# Altium schematic sheet Digital Output.SchDoc
size A4; SheetNumber: 4; SheetTotal: 11
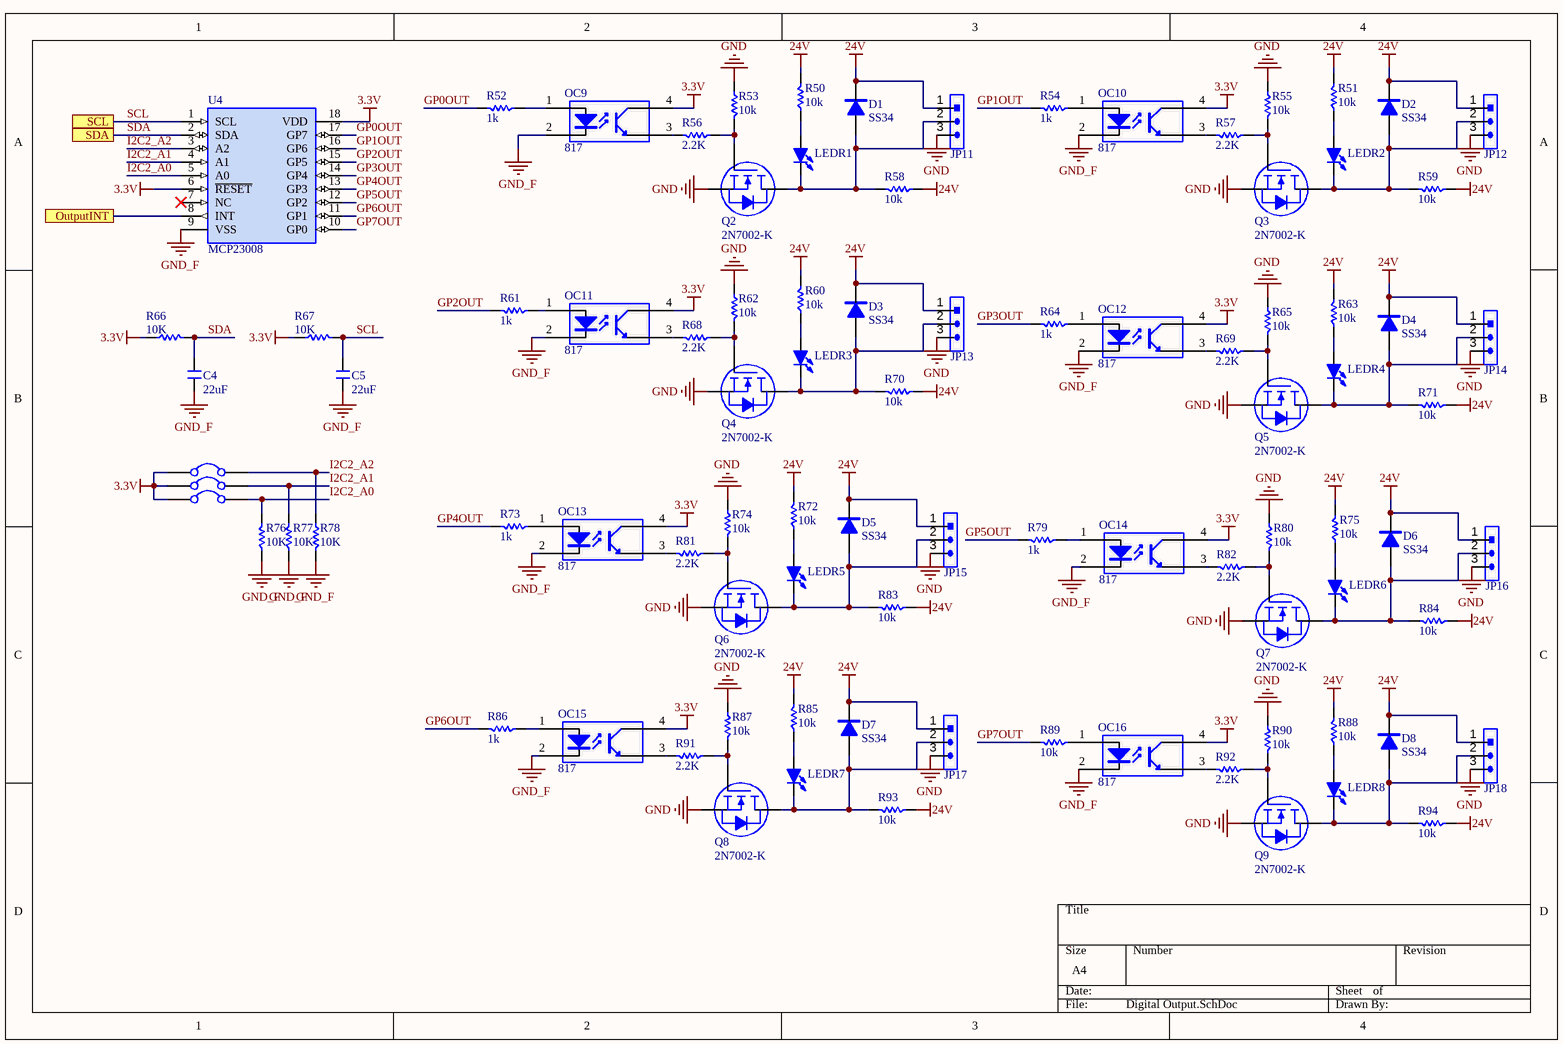
[diagram p0: Digital Output.SchDoc]

## Parts
C4  22uF  [C 0805]
C5  22uF  [C 0805]
D1  SS34  [SMA]
D2  SS34  [SMA]
D3  SS34  [SMA]
D4  SS34  [SMA]
D5  SS34  [SMA]
D6  SS34  [SMA]
D7  SS34  [SMA]
D8  SS34  [SMA]
JP11  HDR-1X3  [KF301-3P]  (value not drawn)
JP12  HDR-1X3  [KF301-3P]  (value not drawn)
JP13  HDR-1X3  [KF301-3P]  (value not drawn)
JP14  HDR-1X3  [KF301-3P]  (value not drawn)
JP15  HDR-1X3  [KF301-3P]  (value not drawn)
JP16  HDR-1X3  [KF301-3P]  (value not drawn)
JP17  HDR-1X3  [KF301-3P]  (value not drawn)
JP18  HDR-1X3  [KF301-3P]  (value not drawn)
LEDR1  LED-SMD  [LED 0805R]  (value not drawn)
LEDR2  LED-SMD  [LED 0805R]  (value not drawn)
LEDR3  LED-SMD  [LED 0805R]  (value not drawn)
LEDR4  LED-SMD  [LED 0805R]  (value not drawn)
LEDR5  LED-SMD  [LED 0805R]  (value not drawn)
LEDR6  LED-SMD  [LED 0805R]  (value not drawn)
LEDR7  LED-SMD  [LED 0805R]  (value not drawn)
LEDR8  LED-SMD  [LED 0805R]  (value not drawn)
OC9  817  [PC817-SMD]
OC10  817  [PC817-SMD]
OC11  817  [PC817-SMD]
OC12  817  [PC817-SMD]
OC13  817  [PC817-SMD]
OC14  817  [PC817-SMD]
OC15  817  [PC817-SMD]
OC16  817  [PC817-SMD]
Q2  2N7002-K  [SOT23-3L]
Q3  2N7002-K  [SOT23-3L]
Q4  2N7002-K  [SOT23-3L]
Q5  2N7002-K  [SOT23-3L]
Q6  2N7002-K  [SOT23-3L]
Q7  2N7002-K  [SOT23-3L]
Q8  2N7002-K  [SOT23-3L]
Q9  2N7002-K  [SOT23-3L]
R50  10k  [R 0805]
R51  10k  [R 0805]
R52  1k  [R 0805]
R53  10k  [R 0805]
R54  1k  [R 0805]
R55  10k  [R 0805]
R56  2.2K  [R 0805]
R57  2.2K  [R 0805]
R58  10k  [R 0805]
R59  10k  [R 0805]
R60  10k  [R 0805]
R61  1k  [R 0805]
R62  10k  [R 0805]
R63  10k  [R 0805]
R64  1k  [R 0805]
R65  10k  [R 0805]
R66  10K  [R 0805]
R67  10K  [R 0805]
R68  2.2K  [R 0805]
R69  2.2K  [R 0805]
R70  10k  [R 0805]
R71  10k  [R 0805]
R72  10k  [R 0805]
R73  1k  [R 0805]
R74  10k  [R 0805]
R75  10k  [R 0805]
R76  10K  [R 0805]
R77  10K  [R 0805]
R78  10K  [R 0805]
R79  1k  [R 0805]
R80  10k  [R 0805]
R81  2.2K  [R 0805]
R82  2.2K  [R 0805]
R83  10k  [R 0805]
R84  10k  [R 0805]
R85  10k  [R 0805]
R86  1k  [R 0805]
R87  10k  [R 0805]
R88  10k  [R 0805]
R89  10k  [R 0805]
R90  10k  [R 0805]
R91  2.2K  [R 0805]
R92  2.2K  [R 0805]
R93  10k  [R 0805]
R94  10k  [R 0805]
SB7  Solder Bridge  [Solder Bridge Open]  (value not drawn)
SB8  Solder Bridge  [Solder Bridge Open]  (value not drawn)
SB9  Solder Bridge  [Solder Bridge Open]  (value not drawn)
U4  MCP23008  [SOP18W_M]

## Ports
OutputINT, SCL, SDA

## Nets
3.3V: OC9.4(C) OC10.4(C) OC11.4(C) OC12.4(C) OC13.4(C) OC14.4(C) OC15.4(C) OC16.4(C) R66.1 R67.1 SB7.1 SB8.1 SB9.1 U4.6(~{RESET}) U4.18(VDD)
24V: D1.2(K) D2.2(K) D3.2(K) D4.2(K) D5.2(K) D6.2(K) D7.2(K) D8.2(K) JP11.1 JP12.1 JP13.1 JP14.1 JP15.1 JP16.1 JP17.1 JP18.1 R50.2 R51.2 R58.1 R59.1 R60.2 R63.2 R70.1 R71.1 R72.2 R75.2 R83.1 R84.1 R85.2 R88.2 R93.1 R94.1
GND: JP11.3 JP12.3 JP13.3 JP14.3 JP15.3 JP16.3 JP17.3 JP18.3 Q2.2(S) Q3.2(S) Q4.2(S) Q5.2(S) Q6.2(S) Q7.2(S) Q8.2(S) Q9.2(S) R53.1 R55.1 R62.1 R65.1 R74.1 R80.1 R87.1 R90.1
GND_F: C4.1 C5.1 OC9.2(K) OC10.2(K) OC11.2(K) OC12.2(K) OC13.2(K) OC14.2(K) OC15.2(K) OC16.2(K) R76.1 R77.1 R78.2 U4.9(VSS)
GP0OUT: R52.2 U4.17(GP7)
GP1OUT: R54.2 U4.16(GP6)
GP2OUT: R61.2 U4.15(GP5)
GP3OUT: R64.2 U4.14(GP4)
GP4OUT: R73.2 U4.13(GP3)
GP5OUT: R79.2 U4.12(GP2)
GP6OUT: R86.2 U4.11(GP1)
GP7OUT: R89.2 U4.10(GP0)
I2C2_A0: R76.2 SB9.2 U4.5(A0)
I2C2_A1: R77.2 SB8.2 U4.4(A1)
I2C2_A2: R78.1 SB7.2 U4.3(A2)
OutputINT: U4.8(INT) ; port OutputINT
SCL: C5.2 R67.2 U4.1(SCL) ; port SCL
SDA: C4.2 R66.2 U4.2(SDA) ; port SDA
NetD1_1: D1.1(A) JP11.2 LEDR1.2(K) Q2.3(D) R58.2
NetD2_1: D2.1(A) JP12.2 LEDR2.2(K) Q3.3(D) R59.2
NetD3_1: D3.1(A) JP13.2 LEDR3.2(K) Q4.3(D) R70.2
NetD4_1: D4.1(A) JP14.2 LEDR4.2(K) Q5.3(D) R71.2
NetD5_1: D5.1(A) JP15.2 LEDR5.2(K) Q6.3(D) R83.2
NetD6_1: D6.1(A) JP16.2 LEDR6.2(K) Q7.3(D) R84.2
NetD7_1: D7.1(A) JP17.2 LEDR7.2(K) Q8.3(D) R93.2
NetD8_1: D8.1(A) JP18.2 LEDR8.2(K) Q9.3(D) R94.2
NetLEDR1_1: LEDR1.1(A) R50.1
NetLEDR2_1: LEDR2.1(A) R51.1
NetLEDR3_1: LEDR3.1(A) R60.1
NetLEDR4_1: LEDR4.1(A) R63.1
NetLEDR5_1: LEDR5.1(A) R72.1
NetLEDR6_1: LEDR6.1(A) R75.1
NetLEDR7_1: LEDR7.1(A) R85.1
NetLEDR8_1: LEDR8.1(A) R88.1
NetOC9_1: OC9.1(A) R52.1
NetOC9_3: OC9.3(E) R56.2
NetOC10_1: OC10.1(A) R54.1
NetOC10_3: OC10.3(E) R57.2
NetOC11_1: OC11.1(A) R61.1
NetOC11_3: OC11.3(E) R68.2
NetOC12_1: OC12.1(A) R64.1
NetOC12_3: OC12.3(E) R69.2
NetOC13_1: OC13.1(A) R73.1
NetOC13_3: OC13.3(E) R81.2
NetOC14_1: OC14.1(A) R79.1
NetOC14_3: OC14.3(E) R82.2
NetOC15_1: OC15.1(A) R86.1
NetOC15_3: OC15.3(E) R91.2
NetOC16_1: OC16.1(A) R89.1
NetOC16_3: OC16.3(E) R92.2
NetQ2_1: Q2.1(G) R53.2 R56.1
NetQ3_1: Q3.1(G) R55.2 R57.1
NetQ4_1: Q4.1(G) R62.2 R68.1
NetQ5_1: Q5.1(G) R65.2 R69.1
NetQ6_1: Q6.1(G) R74.2 R81.1
NetQ7_1: Q7.1(G) R80.2 R82.1
NetQ8_1: Q8.1(G) R87.2 R91.1
NetQ9_1: Q9.1(G) R90.2 R92.1

Not connected (* = marked no-connect by the designer): U4 7(NC)*

## Library data of the parts
C4 C5 = C: Non-polar patch capacitor; BOM名称: 无极性贴片电容; 版权归属: 源创客; 学习资源: www.ooocke.com
D1-D8 = M7: Rectifier diode; BOM名称: 整流二极管; 版权归属: 源创客; 学习资源: www.ooocke.com
JP11-JP18 = Header 3: 3P Connector; BOM名称: 3P接插件; 版权归属: 源创客; 学习资源: www.ooocke.com
LEDR1-LEDR8 = LED-SMD: Patch LED; BOM名称: 贴片LED; 版权归属: 源创客; 学习资源: www.ooocke.com
OC9-OC16 = 817: AC Input Photocoupler; BOM名称: 线性光耦; 版权归属: 源创客; 学习资源: www.ooocke.com
Q2-Q9 = 2N7002-SMD: N-Channel Enhancement Mode Field Effect Transistor
R50-R94 = R: Chip resistor; 版权归属: 源创客; BOM名称: Chip resistor; 学习资源: www.ooocke.com
U4 = MCP23008: 8 Bit I/O Expander